# Altium schematic sheet REUN.ONK.20.000_Work_Tool_E41.SchDoc: Диодный лазерный
size 840 x 594 mm; Date: 10.06.22; ApprovedBy: Шавликов; CheckedBy: Мамаев; DrawnBy: Подлесный; DocumentNumber: РЕУН.941613.002 Э4 2D; SheetNumber: пусто если лист 1, иначе 1; SheetTotal: количество листов; Title1str: 2-х волновой коагулятор; DocumentType: тип схемы; Format: A1; ImagePath: РЕУН.941613.002 ТЭ
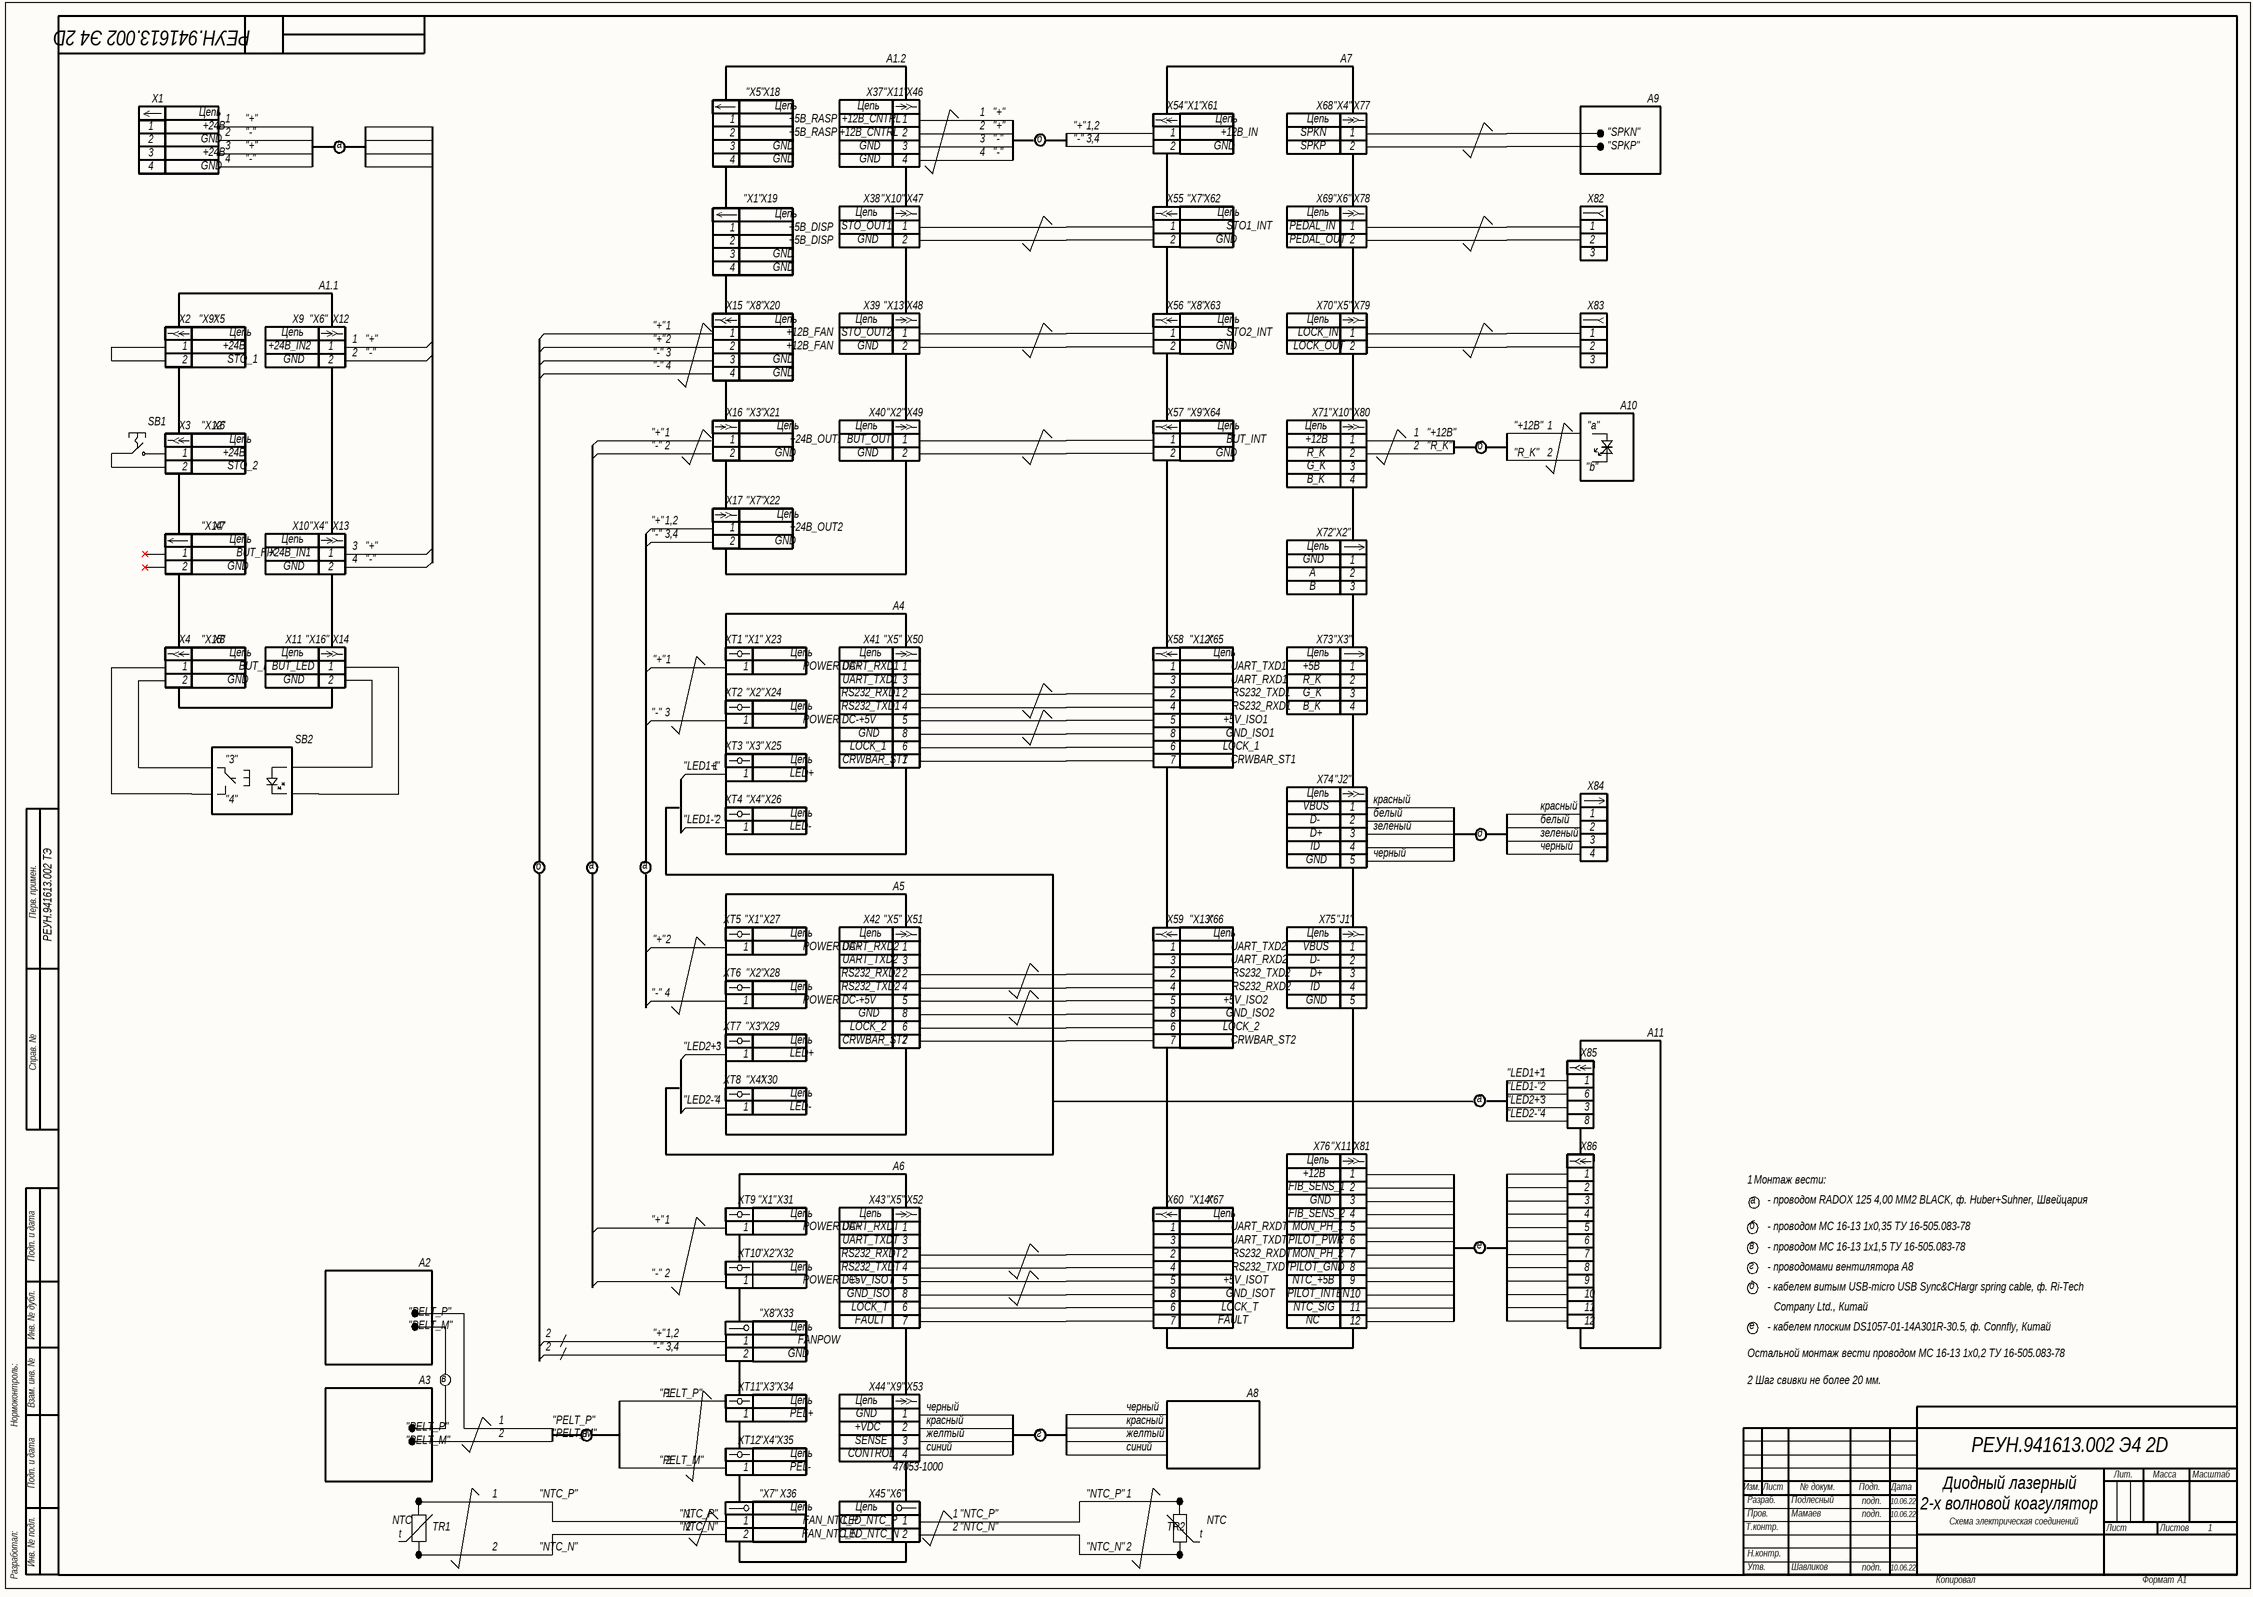
[diagram p0: REUN.ONK.20.000_Work_Tool_E41.SchDoc]

## Notes on the sheet
- А1.2
- А7
- X1
- "X5"
- X18
- Цепь
- X37
- "X11"
- X46
- X54
- "X1"
- X61
- X68
- "X4"
- X77
- A9
- 1
- 2
- GND
- +24В
- +5B_RASP
- +12B_CNTRL
- б
- +12B_IN
- SPKN
- "SPKN"
- 3
- 4
- +24B
- a
- SPKP
- "SPKP"
- X19
- X38
- "X10"
- X47
- X55
- "X7"
- X62
- X69
- "X6"
- X78
- X82
- +5B_DISP
- STO_OUT1
- STO1_INT
- PEDAL_IN
- PEDAL_OUT
- А1.1
- X15
- "X8"
- X20
- X39
- "X13"
- X48
- X56
- X63
- X70
- X79
- X83
- X2
- "X9"
- X5
- X9
- X12
- +12B_FAN
- STO_OUT2
- STO2_INT
- LOCK_IN
- STO_1
- +24B_IN2
- LOCK_OUT
- A10
- SB1
- X3
- "X12"
- X6
- X16
- "X3"
- X21
- +24B_OUT1
- BUT_OUT
- X40
- "X2"
- X49
- X57
- X64
- BUT_INT
- +12B
- X71
- X80
- STO_2
- G_K
- R_K
- X17
- X22
- B_K
- "X14"
- X7
- X10
- X13
- +24B_OUT2
- X72
- BUT_FIX
- +24B_IN1
- A
- A4
- B
- X4
- "X15"
- X8
- X11
- "X16"
- X14
- XT1
- X23
- X41
- X50
- X58
- X65
- X73
- BUT_NFIX
- BUT_LED
- POWER DC+
- UART_RXD1
- UART_TXD1
- +5B
- XT2
- X24
- RS232_TXD1
- RS232_RXD1
- SB2
- XT3
- X25
- POWER DC-
- LOCK_1
- +5V
- 5
- 6
- 8
- +5V_ISO1
- GND_ISO1
- "3"
- LED+
- CRWBAR_ST1
- 7
- X74
- "J2"
- "4"
- XT4
- X26
- VBUS
- X84
- LED-
- D+
- D-
- ID
- д
- Перв. примен.
- A5
- XT5
- X27
- UART_RXD2
- X42
- X51
- X59
- X66
- UART_TXD2
- X75
- "J1"
- XT6
- X28
- RS232_TXD2
- RS232_RXD2
- +5V_ISO2
- GND_ISO2
- Справ. №
- XT7
- X29
- CRWBAR_ST2
- LOCK_2
- X85
- A11
- XT8
- X30
- X76
- X81
- X86
- A6
- FIB_SENS_1
- Монтаж вести:
- XT9
- X31
- X43
- X52
- X60
- X67
- FIB_SENS_2
- - проводом RADOX 125 4,00 ММ2 BLACK, ф. Huber+Suhner, Швейцария
- Подп. и дата
- XT10
- X32
- RS232_RXDT
- UART_RXDT
- UART_TXDT
- PILOT_PWR
- MON_PH_1
- MON_PH_2
- е
- в
- - проводом МС 16-13 1х1,5 ТУ 16-505.083-78
- - проводом МС 16-13 1х0,35 ТУ 16-505.083-78
- A2
- RS232_TXDT
- +5V_ISOT
- PILOT_GND
- NTC_+5B
- 9
- г
- - кабелем витым USB-micro USB Sync&CHargr spring cable, ф. Ri-Tech
- - проводомами вентилятора А8
- Инв. № дубл.
- "PELT_M"
- "PELT_P"
- X33
- GND_ISOT
- LOCK_T
- FAULT
- PILOT_INTEN
- NTC_SIG
- NC
- 10
- 11
- 12
- Company Ltd., Китай
- FANPOW
- Остальной монтаж вести проводом МС 16-13 1х0,2 ТУ 16-505.083-78
- - кабелем плоским DS1057-01-14A301R-30.5, ф. Connfly, Китай
- Нормоконтроль:
- Взам. инв. №
- A3
- XT11
- X34
- X44
- X53
- A8
- 2 Шаг свивки не более 20 мм.
- PEL+
- +VDC
- XT12
- X35
- CONTROL
- SENSE
- "NTC_P"
- X36
- PEL-
- X45
- 47053-1000
- Изм.
- Лист
- № докум.
- Подп.
- Дата
- Лит.
- Масса
- Масштаб
- NTC
- TR1
- "NTC_N"
- FAN_NTC_P
- LED_NTC_P
- TR2
- Т.контр.
- Пров.
- Разраб.
- подп.
- Схема электрическая соединений
- Листов
- Разработал:
- Инв. № подл.
- t
- FAN_NTC_N
- LED_NTC_N
- Н.контр.
- Утв.
- Копировал
- Формат
- Labels drawn without touching a wire or pin: 1, 1,2, 2, 3, 3,4, 4, "+12B", "+", "-", "a", "b", "LED1+", "LED1-", "LED2+", "LED2-", "R_K", белый, желтый, зеленый, красный, синий, черный